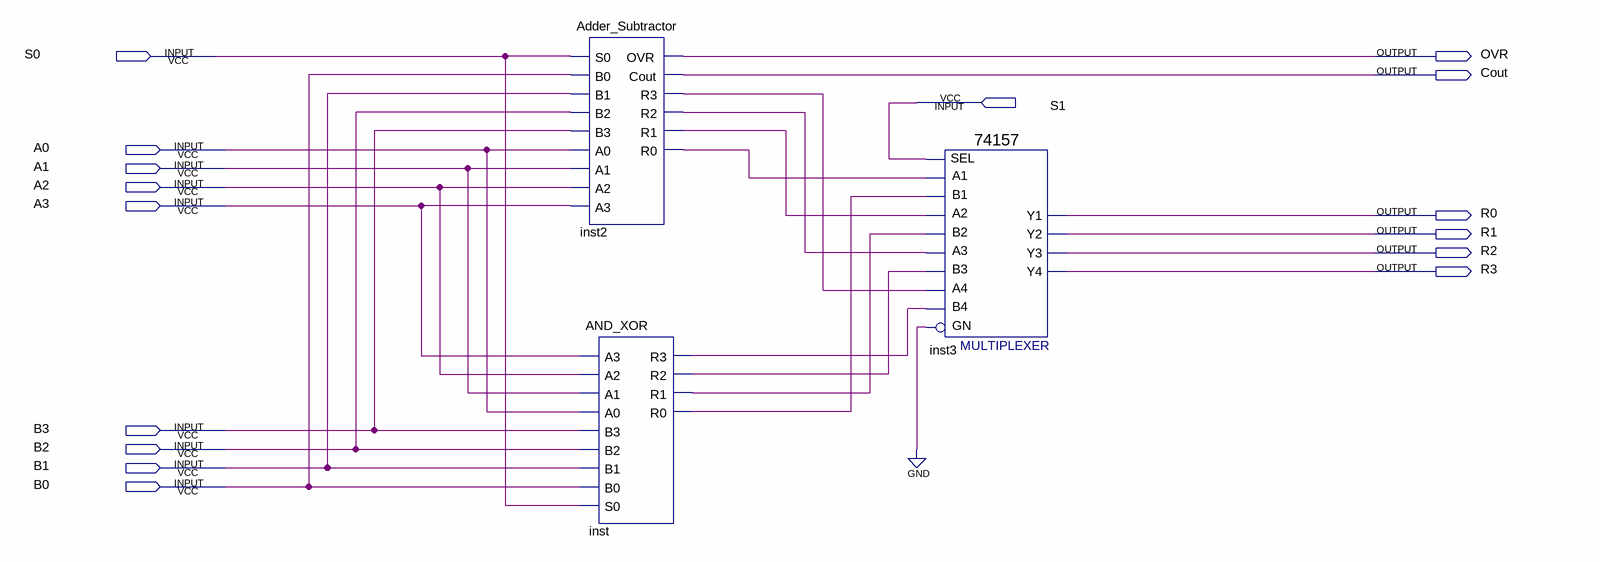
[diagram p0: schematic sheet]
// Quartus schematic ALU.bdf as structural Verilog: 3 symbols, 16 pins
module ALU (
  input  S0,
  input  S1,
  input  A0,
  input  A1,
  input  A2,
  input  A3,
  input  B3,
  input  B2,
  input  B1,
  input  B0,
  output OVR,
  output Cout,
  output R0,
  output R1,
  output R2,
  output R3
);

  wire inst2_r0, inst2_r1, inst2_r2, inst2_r3, inst_r0, inst_r1, inst_r2, inst_r3;

  Adder_Subtractor inst2 (
    .S0(S0), .B0(B0), .B1(B1), .B2(B2), .B3(B3), .A0(A0), .A1(A1), .A2(A2), .A3(A3), .OVR(OVR), .Cout(Cout),
    .R3(inst2_r3), .R2(inst2_r2), .R1(inst2_r1), .R0(inst2_r0));
  AND_XOR inst (
    .A3(A3), .A2(A2), .A1(A1), .A0(A0), .B3(B3), .B2(B2), .B1(B1), .B0(B0), .S0(S0), .R3(inst_r3),
    .R2(inst_r2), .R1(inst_r1), .R0(inst_r0));
  \74157  inst3 (
    .A1(inst2_r0), .B1(inst_r0), .SEL(S1), .B2(inst_r1), .A3(inst2_r2), .B3(inst_r2), .A2(inst2_r1),
    .B4(inst_r3), .GN(1'b0), .A4(inst2_r3), .Y2(R1), .Y1(R0), .Y4(R3), .Y3(R2));
endmodule
